# Altium schematic sheet UserComponents.SchDoc
size A4
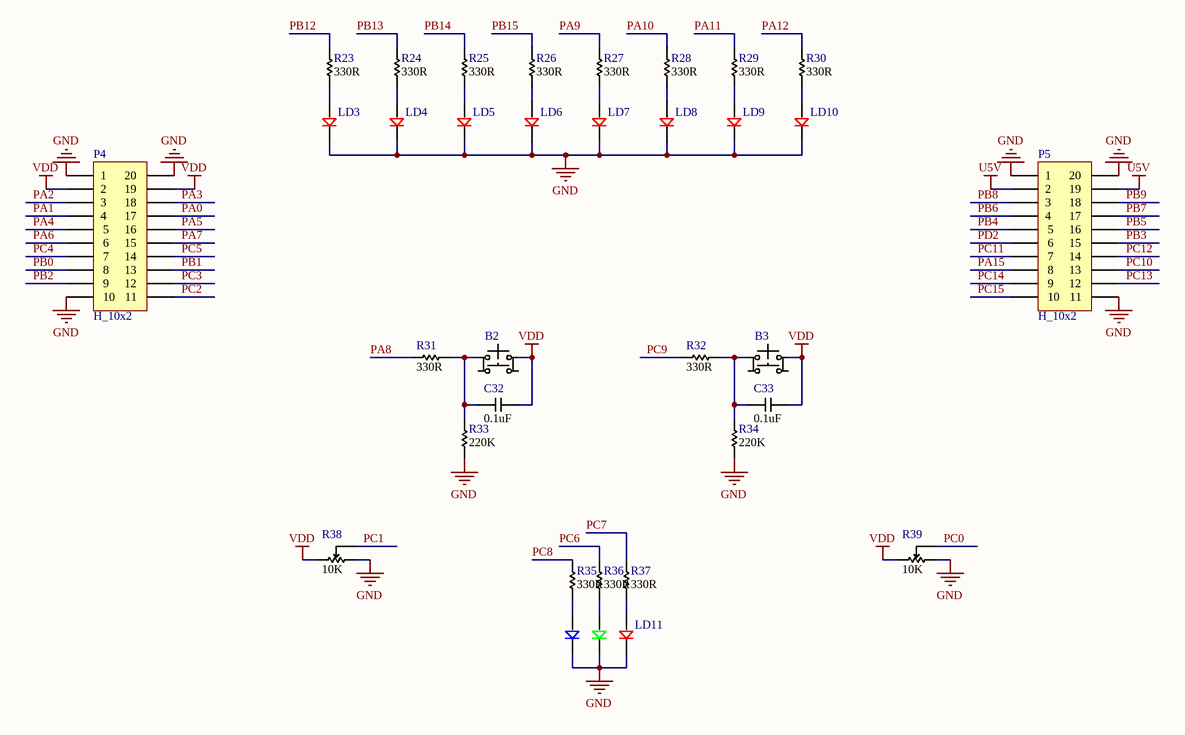
[diagram p0: UserComponents.SchDoc]

## Parts
B2  DTSM-65R-V-T/R  [Diptronics_DTSM-65_Red_4]  (value not drawn)
B3  DTSM-65R-V-T/R  [Diptronics_DTSM-65_Red_4]  (value not drawn)
C32  value 0.1uF  [Kemet_0805_X7R]  (hidden comment: C0805C104K3RACTU)
C33  value 0.1uF  [Kemet_0805_X7R]  (hidden comment: C0805C104K3RACTU)
LD3  17-21/R6C-AP1Q2L/3T  [Everlight_17-21]  (value not drawn)
LD4  17-21/R6C-AP1Q2L/3T  [Everlight_17-21]  (value not drawn)
LD5  17-21/R6C-AP1Q2L/3T  [Everlight_17-21]  (value not drawn)
LD6  17-21/R6C-AP1Q2L/3T  [Everlight_17-21]  (value not drawn)
LD7  17-21/R6C-AP1Q2L/3T  [Everlight_17-21]  (value not drawn)
LD8  17-21/R6C-AP1Q2L/3T  [Everlight_17-21]  (value not drawn)
LD9  17-21/R6C-AP1Q2L/3T  [Everlight_17-21]  (value not drawn)
LD10  17-21/R6C-AP1Q2L/3T  [Everlight_17-21]  (value not drawn)
LD11  HLAF5060H248BS36FU76GCS1  [Honglitronic_5050]  (value not drawn)
P4  H_10x2  [HEADER_HDRV20W65P254_10X2_2540X508H945]
P5  H_10x2  [HEADER_HDRV20W65P254_10X2_2540X508H945]
R23  value 330R  [VISHAY_RESC205X125X50L35_30N]  (hidden comment: CRCW08050000Z0EA)
R24  value 330R  [VISHAY_RESC205X125X50L35_30N]  (hidden comment: CRCW08050000Z0EA)
R25  value 330R  [VISHAY_RESC205X125X50L35_30N]  (hidden comment: CRCW08050000Z0EA)
R26  value 330R  [VISHAY_RESC205X125X50L35_30N]  (hidden comment: CRCW08050000Z0EA)
R27  value 330R  [VISHAY_RESC205X125X50L35_30N]  (hidden comment: CRCW08050000Z0EA)
R28  value 330R  [VISHAY_RESC205X125X50L35_30N]  (hidden comment: CRCW08050000Z0EA)
R29  value 330R  [VISHAY_RESC205X125X50L35_30N]  (hidden comment: CRCW08050000Z0EA)
R30  value 330R  [VISHAY_RESC205X125X50L35_30N]  (hidden comment: CRCW08050000Z0EA)
R31  value 330R  [VISHAY_RESC205X125X50L35_30N]  (hidden comment: CRCW08050000Z0EA)
R32  value 330R  [VISHAY_RESC205X125X50L35_30N]  (hidden comment: CRCW08050000Z0EA)
R33  value 220K  [VISHAY_RESC205X125X50L35_30N]  (hidden comment: CRCW08050000Z0EA)
R34  value 220K  [VISHAY_RESC205X125X50L35_30N]  (hidden comment: CRCW08050000Z0EA)
R35  value 330R  [VISHAY_RESC205X125X50L35_30N]  (hidden comment: CRCW08050000Z0EA)
R36  value 330R  [VISHAY_RESC205X125X50L35_30N]  (hidden comment: CRCW08050000Z0EA)
R37  value 330R  [VISHAY_RESC205X125X50L35_30N]  (hidden comment: CRCW08050000Z0EA)
R38  value 10K  [Bonens_3386F]  (hidden comment: 3386F-1-103LF-BN)
R39  value 10K  [Bonens_3386F]  (hidden comment: 3386F-1-103LF-BN)

## Nets
GND: LD3.2(R-) LD4.2(R-) LD5.2(R-) LD6.2(R-) LD7.2(R-) LD8.2(R-) LD9.2(R-) LD10.2(R-) LD11.4(B-) LD11.5(R-) LD11.6(G-) P4.1 P4.10 P4.20 P5.1 P5.11 P5.20 R33.2 R34.2 R38.3 R39.3
U5V: P5.2 P5.19
VDD: B2.3 B3.3 C32.2 C33.2 P4.2 P4.19 R38.1 R39.1
PA0: P4.17
PA1: P4.4
PA2: P4.3
PA3: P4.18
PA4: P4.5
PA5: P4.16
PA6: P4.6
PA7: P4.15
PA8: R31.1
PA9: R27.2
PA10: R28.2
PA11: R29.2
PA12: R30.2
PA15: P5.8
PB0: P4.8
PB1: P4.13
PB2: P4.9
PB3: P5.15
PB4: P5.5
PB5: P5.16
PB6: P5.4
PB7: P5.17
PB8: P5.3
PB9: P5.18
PB12: R23.2
PB13: R24.2
PB14: R25.2
PB15: R26.2
PC0: R39.2
PC1: R38.2
PC2: P4.11
PC3: P4.12
PC4: P4.7
PC5: P4.14
PC6: R36.2
PC7: R37.2
PC8: R35.2
PC9: R32.1
PC10: P5.13
PC11: P5.7
PC12: P5.14
PC13: P5.12
PC14: P5.9
PC15: P5.10
PD2: P5.6
NetB2_1: B2.1 C32.1 R31.2 R33.1
NetB3_1: B3.1 C33.1 R32.2 R34.1
NetLD3_1: LD3.1(R+) R23.1
NetLD4_1: LD4.1(R+) R24.1
NetLD5_1: LD5.1(R+) R25.1
NetLD6_1: LD6.1(R+) R26.1
NetLD7_1: LD7.1(R+) R27.1
NetLD8_1: LD8.1(R+) R28.1
NetLD9_1: LD9.1(R+) R29.1
NetLD10_1: LD10.1(R+) R30.1
NetLD11_1: LD11.1(G+) R36.1
NetLD11_2: LD11.2(R+) R37.1
NetLD11_3: LD11.3(B+) R35.1

Not connected (* = marked no-connect by the designer): B2 2 4; B3 2 4

## Library data of the parts
B2 B3 = DTSM-65R-V-T/R: Button_SMD_4_6x6x9.5_Diptronics; Dimensions: 6x6x9.5; Mounting Type: SMT; Manufacturer: Diptronics; Purchase Link: https://www.ozdisan.com/elektromekanik-komponentler/sivicler-anahtarlar/tact-sivicler/DTSM-65R-V-TR; Package: DTSM-65; Number of Pins: 4; Color: Red
C32 C33 = C0805C104K3RACTU: Cap_0805_0.1uF_25VDC_Kemet; Manufacturer: Kemet; Voltage: 25VDC; Tolerance: 10%; Dimensions: 2x1.25x0.9; Mounting Type: SMT; Package: 0805; Purchase Link: https://www.ozdisan.com/pasif-komponentler/kondansatorler/smd-kondansatorler-mlcc/C0805C105K4RACTU
LD3-LD10 = 17-21/R6C-AP1Q2L/3T: Led_R_1.7V_25mA_Everlight; Forward Current: 25mA; Forward Voltage: 1.7V; Color: R; Manufacturer: Everlight; Package: 0805; Dimensions: -; Mounting Type: SMT; Purchase Link: https://www.ozdisan.com/led-led-aydinlatma-cozumleri/led-komponentler/renkli-led-sinyal/17-21R6C-AP1Q2L3T
LD11 = HLAF5060H248BS36FU76GCS1: Led_RGB_1.8-2.8-2.8V_3x90mA_Honglitronic; Forward Current: 3x90mA; Color: RGB; Manufacturer: Honglitronic; Forward Voltage: 1.8-2.8-2.8V; Package: 5050; Dimensions: -; Mounting Type: SMT; Purchase Link: https://www.ozdisan.com/led-led-aydinlatma-cozumleri/led-komponentler/renkli-led-aydinlatma/HLAF5060H248BS36FU76GCS1
P4 P5 = H_10x2: Head_10x2_2.54; Pitch: 2.54mm; Position of Pins: V; Manufacturer: -; Number of Pins: 10x2; Mounting Type: TH; Purchase Link: -; Dimensions: -
R23-R37 = CRCW08050000Z0EA: Res_0805_0R_1/8W_Vishay; Manufacturer: Vishay; Power: 1/8W; Tolerance: Jumper; Dimensions: 2x1.25x0.45; Mounting Type: SMT; Package: 0805; Purchase Link: https://www.ozdisan.com/pasif-komponentler/direncler/smt-smd-direncler/CRCW08050000Z0EA
R38 R39 = 3386F-1-103LF-BN: Trimpot_10K_Bonens; Manufacturer: Bonens; Dimensions: 9.5x9.5x5; Mounting Type: TH; Package: 3386F; Power: -; Tolerance: -; Purchase Link: https://www.ozdisan.com/elektromekanik-komponentler/potansiyometre-trimpotlar/trimpot-potansiyometreler/3386F-1-103LF-BN